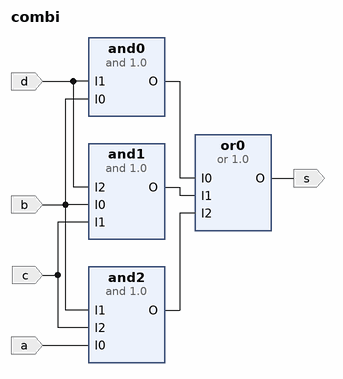
[diagram p0: block diagram of the top level]
# Vivado block design combi, xc7a35tcpg236-1, Vivado 2018.2.1
create_bd_design combi

create_bd_port -dir I -type data b
create_bd_port -dir I -type data d
create_bd_port -dir I -type data c
create_bd_port -dir I -type data a
create_bd_port -dir O -type data s

create_bd_cell -type ip -vlnv FIT:user:and:1.0 and0
set_property -dict {CONFIG.I0_Inverted false CONFIG.I1_inverted true} [get_bd_cells and0]
create_bd_cell -type ip -vlnv FIT:user:and:1.0 and1
set_property -dict {CONFIG.Inputs 3 CONFIG.I0_Inverted true CONFIG.I1_inverted true} [get_bd_cells and1]
create_bd_cell -type ip -vlnv FIT:user:and:1.0 and2
set_property -dict {CONFIG.Inputs 3 CONFIG.I0_Inverted true CONFIG.I1_inverted true CONFIG.I2_inverted true} [get_bd_cells and2]
create_bd_cell -type ip -vlnv FIT:user:or:1.0 or0
set_property -dict {CONFIG.Inputs 3} [get_bd_cells or0]

# ---- connections ----

connect_bd_net -net I0_0_1 [get_bd_ports b] [get_bd_pins and0/I0] [get_bd_pins and1/I0] [get_bd_pins and2/I1]
connect_bd_net -net I1_0_1 [get_bd_ports d] [get_bd_pins and0/I1] [get_bd_pins and1/I2]
connect_bd_net [get_bd_pins and0/O] [get_bd_pins or0/I0]
connect_bd_net -net I1_0_2 [get_bd_ports c] [get_bd_pins and1/I1] [get_bd_pins and2/I2]
connect_bd_net -net I0_0_2 [get_bd_ports a] [get_bd_pins and2/I0]
connect_bd_net [get_bd_pins and1/O] [get_bd_pins or0/I1]
connect_bd_net [get_bd_pins and2/O] [get_bd_pins or0/I2]
connect_bd_net [get_bd_pins or0/O] [get_bd_ports s]

validate_bd_design
save_bd_design
